# Altium schematic sheet Sheet1.SchDoc
size A; SheetNumber: 1; SheetTotal: 1
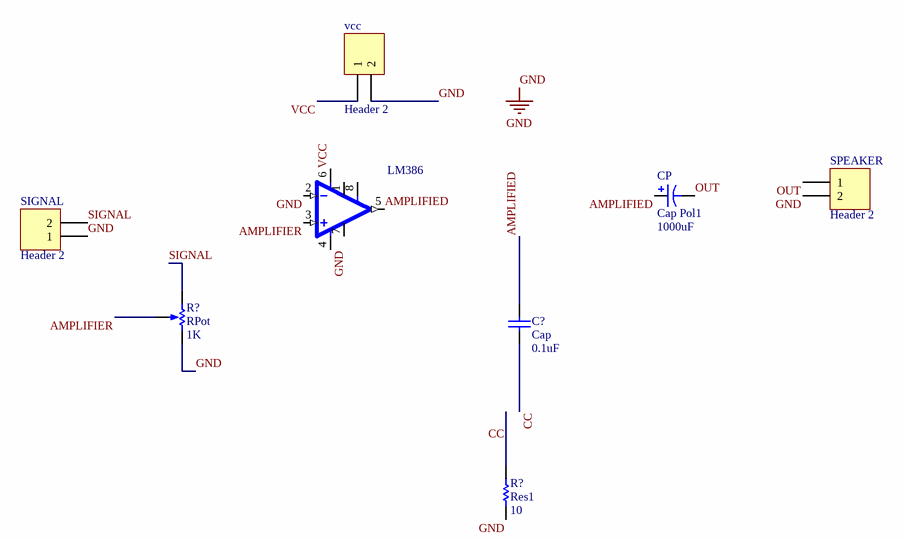
[diagram p0: Sheet1.SchDoc]

## Parts
(Parts that share a designator on the sheet are numbered #1, #2 ... from top to bottom, then left to right.)
C?  Cap  value 0.1uF  [RAD-0.3]
CP  Cap Pol1  value 1000uF  [RB7.6-15]
LM386  (no value)  [DIP08]
R?#1  RPot  value 1K  [VR5]
R?#2  Res1  value 10  [AXIAL-0.3]
SIGNAL  Header 2  [HDR1X2]
SPEAKER  Header 2  [HDR1X2]
vcc  Header 2  [HDR1X2]

## Nets
GND: LM386.2(-IN) LM386.4(V-) R?#1.2(BOT) R?#2.2 SIGNAL.1 SPEAKER.2 vcc.2
AMPLIFIED: C?.2 CP.1 LM386.5(OUT)
AMPLIFIER: LM386.3(+IN) R?#1.3(TAP)
CC: C?.1 R?#2.1
OUT: CP.2 SPEAKER.1
SIGNAL: R?#1.1(TOP) SIGNAL.2
VCC: LM386.6(V+) vcc.1

Not connected (* = marked no-connect by the designer): LM386 1(GAIN@1) 7(BP) 8(GAIN@8)

## Library data of the parts
C? = Cap: Capacitor; Published: 8-Jun-2000; LatestRevisionDate: 17-Jul-2002; LatestRevisionNote: Re-released for DXP Platform.; PackageReference: RAD-0.3; Publisher: Altium Limited; PackageDescription: Radial Cap, Thru-Hole; 2 Leads; 0.3 in Pin Spacing
CP = Cap Pol1: Polarized Capacitor (Radial); Published: 8-Jun-2000; LatestRevisionDate: 17-Jul-2002; LatestRevisionNote: Re-released for DXP Platform.; PackageReference: RB7.6-15; Publisher: Altium Limited; PackageDescription: Polarized Capacitor (Radial); 2 Leads
LM386 = LM386: low voltage audio power amplifier; MP: LM386; Price: None; Package: None; Value: *; Availability: Unavailable
R?#1 = RPot: Potentiometer; Sim Note: Enter the Resistance value and the set point into parameter fields.; Set Position: 0.5; Published: 8-Jun-2000; LatestRevisionDate: 17-Jul-2002; LatestRevisionNote: Re-released for DXP Platform.; PackageReference: VR5; Publisher: Altium Limited; PackageDescription: Variable Resistor, Thru-Hole; 3 Leads
R?#2 = Res1: Resistor; Published: 8-Jun-2000; LatestRevisionDate: 17-Jul-2002; LatestRevisionNote: Re-released for DXP Platform.; PackageReference: AXIAL-0.3; Publisher: Altium Limited; PackageDescription: Axial Device, Thru-Hole; 2 Leads; 0.3 in Pin Spacing
SIGNAL SPEAKER vcc = Header 2: Header, 2-Pin; LatestRevisionDate: 17-Jul-2002; LatestRevisionNote: Re-released for DXP Platform.; Publisher: Altium Limited